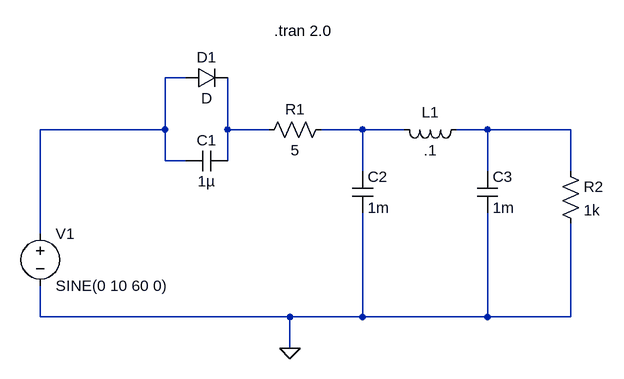
[diagram p0: schematic simple_power_supply.asc]
simple_power_supply.asc, the LTspice schematic file:
Version 4
SHEET 1 880 680
WIRE 48 176 16 176
WIRE 16 256 16 176
WIRE 16 256 -176 256
WIRE 112 256 112 176
WIRE 176 256 112 256
WIRE 320 256 256 256
WIRE 384 256 320 256
WIRE 512 256 464 256
WIRE 640 256 512 256
WIRE 16 304 16 256
WIRE 48 304 16 304
WIRE 112 304 112 256
WIRE 320 320 320 256
WIRE 512 320 512 256
WIRE 640 320 640 256
WIRE -176 416 -176 256
WIRE -176 544 -176 496
WIRE 208 544 -176 544
WIRE 320 544 320 384
WIRE 320 544 208 544
WIRE 512 544 512 384
WIRE 512 544 320 544
WIRE 640 544 640 400
WIRE 640 544 512 544
WIRE 208 592 208 544
FLAG 208 592 0
SYMBOL voltage -176 400 R0
SYMATTR InstName V1
SYMATTR Value SINE(0 10 60 0)
SYMBOL diode 48 192 R270
WINDOW 0 32 32 VTop 2
WINDOW 3 0 32 VBottom 2
SYMATTR InstName D1
SYMBOL Cap 112 288 R90
WINDOW 0 0 32 VBottom 2
WINDOW 3 32 32 VTop 2
SYMATTR InstName C1
SYMATTR Value 1µ
SYMBOL Res 272 240 R90
WINDOW 0 0 56 VBottom 2
WINDOW 3 32 56 VTop 2
SYMATTR InstName R1
SYMATTR Value 5
SYMBOL Res 624 304 R0
SYMATTR InstName R2
SYMATTR Value 1k
SYMBOL ind 480 240 R90
WINDOW 0 5 56 VBottom 2
WINDOW 3 32 56 VTop 2
SYMATTR InstName L1
SYMATTR Value .1
SYMBOL Cap 304 320 R0
SYMATTR InstName C2
SYMATTR Value 1m
SYMBOL Cap 496 320 R0
SYMATTR InstName C3
SYMATTR Value 1m
TEXT 184 104 Left 2 !.tran 2.0

The netlist it stands for:
* simple_power_supply.asc
V1 N001 0 SINE(0 10 60 0)
D1 N001 N002 D
C1 N002 N001 1µ
R1 N003 N002 5
R2 N004 0 1k
L1 N004 N003 .1
C2 N003 0 1m
C3 N004 0 1m
.model D D
.lib standard.dio
.tran 2.0
.backanno
.end